# Altium schematic sheet Tp_Connector.SchDoc
size A4
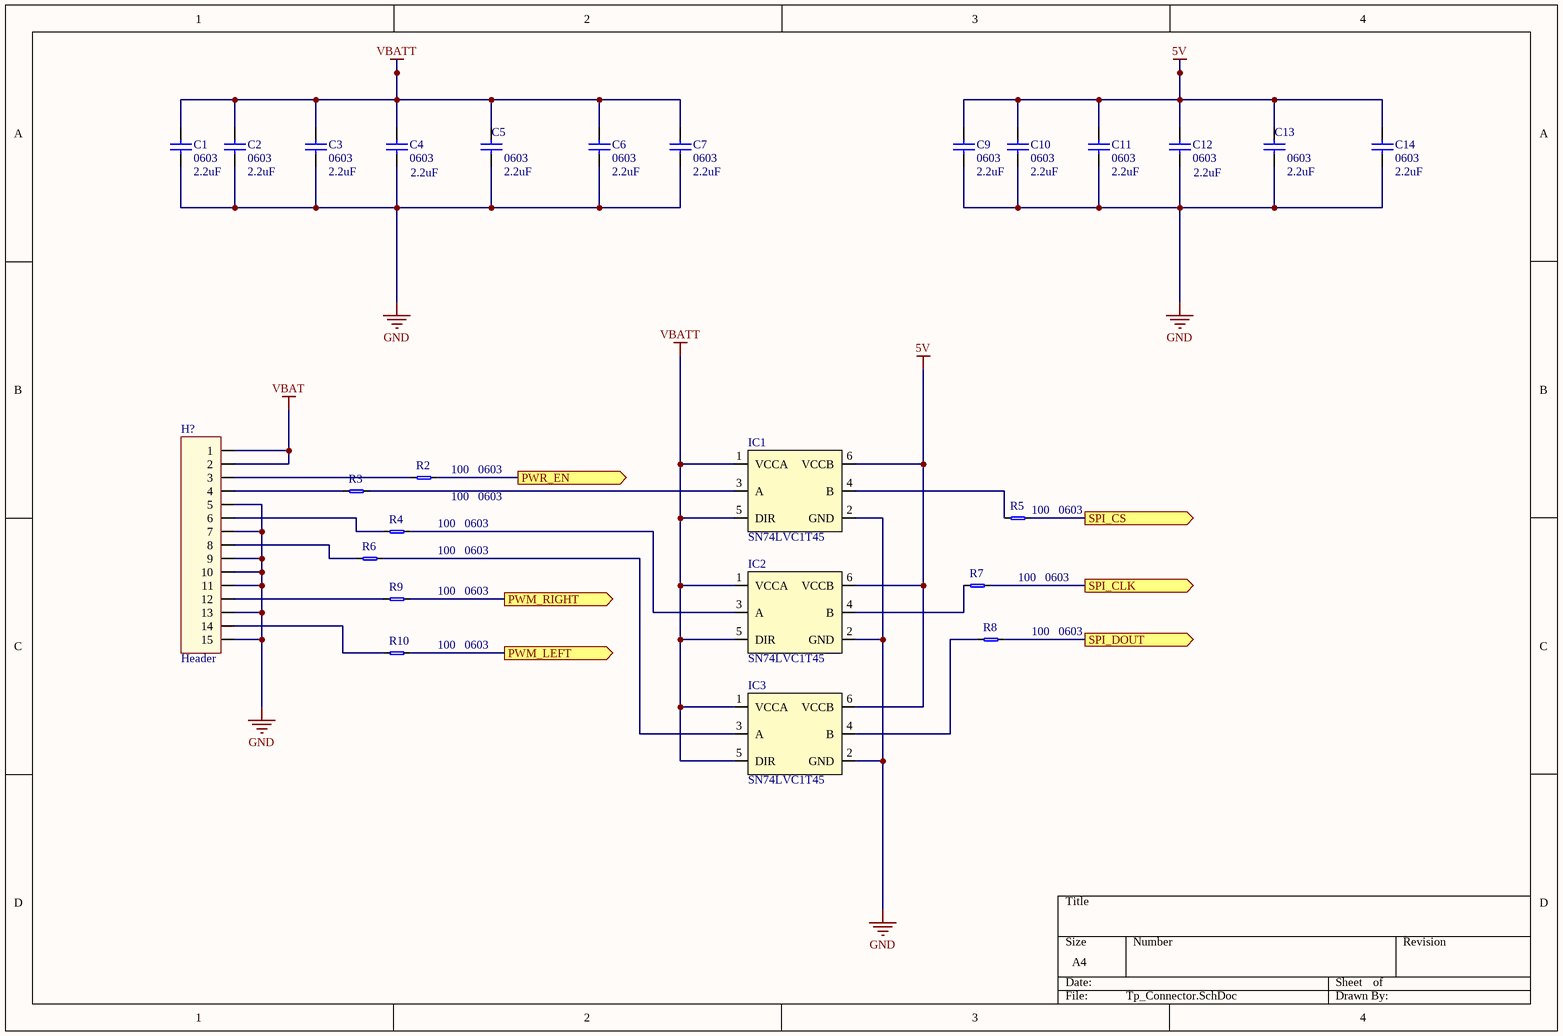
[diagram p0: Tp_Connector.SchDoc]

## Parts
C1  0603  value 2.2uF  [RAD-0.3]
C2  0603  value 2.2uF  [RAD-0.3]
C3  0603  value 2.2uF  [RAD-0.3]
C4  0603  value 2.2uF  [RAD-0.3]
C5  0603  value 2.2uF  [RAD-0.3]
C6  0603  value 2.2uF  [RAD-0.3]
C7  0603  value 2.2uF  [RAD-0.3]
C9  0603  value 2.2uF  [RAD-0.3]
C10  0603  value 2.2uF  [RAD-0.3]
C11  0603  value 2.2uF  [RAD-0.3]
C12  0603  value 2.2uF  [RAD-0.3]
C13  0603  value 2.2uF  [RAD-0.3]
C14  0603  value 2.2uF  [RAD-0.3]
H?  Header  [653115131822]
IC1  SN74LVC1T45  [MO-203AB_LD]
IC2  SN74LVC1T45  [MO-203AB_LD]
IC3  SN74LVC1T45  [MO-203AB_LD]
R2  value 100  Package: 0603  [0402_RES_LD]  (hidden comment: Resistor)
R3  value 100  Package: 0603  [0402_RES_LD]  (hidden comment: Resistor)
R4  value 100  Package: 0603  [0402_RES_LD]  (hidden comment: Resistor)
R5  value 100  Package: 0603  [0402_RES_LD]  (hidden comment: Resistor)
R6  value 100  Package: 0603  [0402_RES_LD]  (hidden comment: Resistor)
R7  value 100  Package: 0603  [0402_RES_LD]  (hidden comment: Resistor)
R8  value 100  Package: 0603  [0402_RES_LD]  (hidden comment: Resistor)
R9  value 100  Package: 0603  [0402_RES_LD]  (hidden comment: Resistor)
R10  value 100  Package: 0603  [0402_RES_LD]  (hidden comment: Resistor)

## Ports
PWM_LEFT (out), PWM_RIGHT (out), PWR_EN (out), SPI_CLK (out), SPI_CS (out), SPI_DOUT (out)

## Nets
5V: C9.2 C10.2 C11.2 C12.2 C13.2 C14.2 IC1.6(VCCB) IC2.6(VCCB) IC3.6(VCCB)
GND: C1.1 C2.1 C3.1 C4.1 C5.1 C6.1 C7.1 C9.1 C10.1 C11.1 C12.1 C13.1 C14.1 H?.5 H?.7 H?.9 H?.10 H?.11 H?.13 H?.15 IC1.2(GND) IC2.2(GND) IC3.2(GND)
VBAT: H?.1 H?.2
VBATT: C1.2 C2.2 C3.2 C4.2 C5.2 C6.2 C7.2 IC1.1(VCCA) IC1.5(DIR) IC2.1(VCCA) IC2.5(DIR) IC3.1(VCCA) IC3.5(DIR)
PWM_LEFT: R10.2 ; port PWM_LEFT
PWM_RIGHT: R9.2 ; port PWM_RIGHT
PWR_EN: R2.2 ; port PWR_EN
SPI_CLK: R7.2 ; port SPI_CLK
SPI_CS: R5.2 ; port SPI_CS
SPI_DOUT: R8.2 ; port SPI_DOUT
NetH?_3: H?.3 R2.1
NetH?_4: H?.4 R3.1
NetH?_6: H?.6 R4.1
NetH?_8: H?.8 R6.1
NetH?_12: H?.12 R9.1
NetH?_14: H?.14 R10.1
NetIC1_3: IC1.3(A) R3.2
NetIC1_4: IC1.4(B) R5.1
NetIC2_3: IC2.3(A) R4.2
NetIC2_4: IC2.4(B) R7.1
NetIC3_3: IC3.3(A) R6.2
NetIC3_4: IC3.4(B) R8.1

## Library data of the parts
C1-C7 C9-C14 = Cap: Capacitor; Published: 8-Jun-2000; LatestRevisionDate: 17-Jul-2002; LatestRevisionNote: Re-released for DXP Platform.; PackageReference: RAD-0.3; Publisher: Altium Limited; PackageDescription: Radial Cap, Thru-Hole; 2 Leads; 0.3 in Pin Spacing
H? = HEADER_15x1: Header 15x1
IC1-IC3 = SN74LVC1T45: Single Bit Dual Supply Buffer
R2-R10 = Resistor: Precision: *